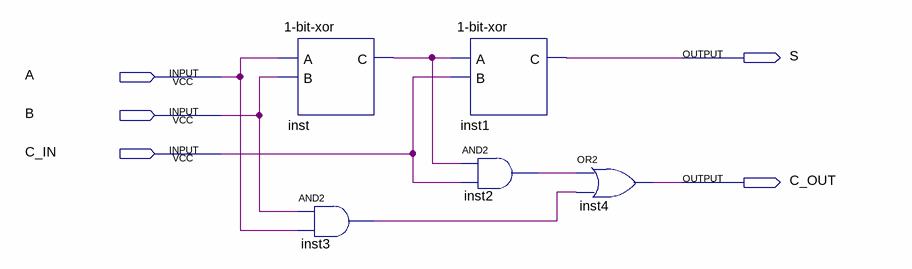
[diagram p0: schematic sheet]
// Quartus schematic 1-bit-full-adder.bdf as structural Verilog: 5 symbols, 5 pins
module \1-bit-full-adder  (
  input  A,
  input  B,
  input  C_IN,
  output S,
  output C_OUT
);

  wire inst2_out, inst3_out, inst_c;

  \1-bit-xor  inst (.A(A), .B(B), .C(inst_c));
  and inst3 (inst3_out, B, A);
  \1-bit-xor  inst1 (.A(inst_c), .B(C_IN), .C(S));
  and inst2 (inst2_out, inst_c, C_IN);
  or inst4 (C_OUT, inst2_out, inst3_out);
endmodule
